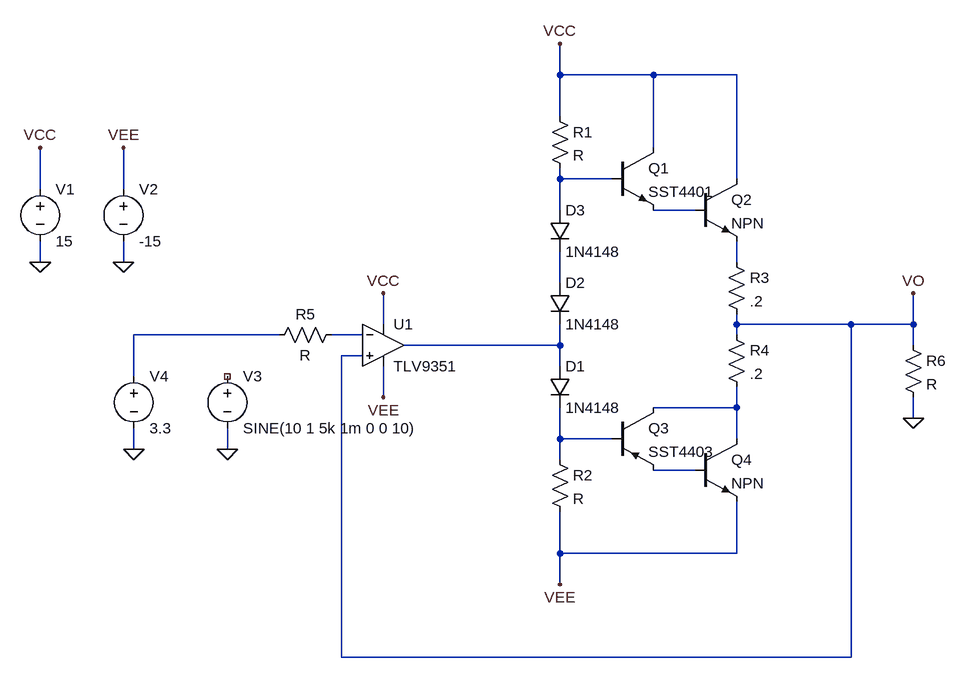
[diagram p0: schematic Current Amp-PowerAmp.asc]
Current Amp-PowerAmp.asc, the LTspice schematic file:
Version 4
SHEET 1 1016 692
WIRE 416 -208 416 -256
WIRE 560 -208 416 -208
WIRE 688 -208 560 -208
WIRE 416 -144 416 -208
WIRE 560 -96 560 -208
WIRE 416 -48 416 -64
WIRE 496 -48 416 -48
WIRE 688 -48 688 -208
WIRE -384 -32 -384 -96
WIRE -256 -32 -256 -96
WIRE 416 0 416 -48
WIRE 624 0 560 0
WIRE -384 80 -384 48
WIRE -256 80 -256 48
WIRE 688 80 688 48
WIRE 416 112 416 64
WIRE 144 176 144 128
WIRE 688 176 688 160
WIRE 864 176 688 176
WIRE 960 176 960 128
WIRE 960 176 864 176
WIRE -16 192 -240 192
WIRE 112 192 64 192
WIRE 688 192 688 176
WIRE 416 208 416 176
WIRE 416 208 176 208
WIRE 960 208 960 176
WIRE 112 224 80 224
WIRE 416 240 416 208
WIRE -240 256 -240 192
WIRE 144 288 144 240
WIRE 688 304 688 272
WIRE 688 304 560 304
WIRE 960 320 960 288
WIRE 416 352 416 304
WIRE 496 352 416 352
WIRE 688 352 688 304
WIRE -240 368 -240 336
WIRE -96 368 -96 336
WIRE 416 384 416 352
WIRE 624 400 560 400
WIRE 416 528 416 464
WIRE 688 528 688 448
WIRE 688 528 416 528
WIRE 416 576 416 528
WIRE 80 688 80 224
WIRE 864 688 864 176
WIRE 864 688 80 688
FLAG -384 80 0
FLAG -256 80 0
FLAG -384 -96 VCC
FLAG -256 -96 VEE
FLAG 144 128 VCC
FLAG 144 288 VEE
FLAG -240 368 0
FLAG -96 368 0
FLAG 416 -256 VCC
FLAG 416 576 VEE
FLAG 960 320 0
FLAG 960 128 VO
SYMBOL Hab_OpAmp\\TLV9351 144 144 R0
SYMATTR InstName U1
SYMBOL voltage -384 -48 R0
WINDOW 123 0 0 Left 0
WINDOW 39 0 0 Left 0
SYMATTR InstName V1
SYMATTR Value 15
SYMBOL voltage -256 -48 R0
WINDOW 123 0 0 Left 0
WINDOW 39 0 0 Left 0
SYMATTR InstName V2
SYMATTR Value -15
SYMBOL diode 400 240 R0
SYMATTR InstName D1
SYMATTR Value 1N4148
SYMBOL diode 400 112 R0
SYMATTR InstName D2
SYMATTR Value 1N4148
SYMBOL diode 400 0 R0
SYMATTR InstName D3
SYMATTR Value 1N4148
SYMBOL npn 496 -96 R0
SYMATTR InstName Q1
SYMATTR Value SST4401
SYMBOL npn 624 -48 R0
SYMATTR InstName Q2
SYMBOL pnp 496 304 R0
SYMATTR InstName Q3
SYMATTR Value SST4403
SYMBOL npn 624 352 R0
SYMATTR InstName Q4
SYMBOL res 400 -160 R0
SYMATTR InstName R1
SYMBOL res 400 368 R0
SYMATTR InstName R2
SYMBOL res 672 64 R0
SYMATTR InstName R3
SYMATTR Value .2
SYMBOL res 672 176 R0
SYMATTR InstName R4
SYMATTR Value .2
SYMBOL res 80 176 R90
WINDOW 0 0 56 VBottom 2
WINDOW 3 32 56 VTop 2
SYMATTR InstName R5
SYMBOL voltage -96 240 R0
WINDOW 123 0 0 Left 0
WINDOW 39 0 0 Left 0
SYMATTR InstName V3
SYMATTR Value SINE(10 1 5k 1m 0 0 10)
SYMBOL voltage -240 240 R0
WINDOW 123 0 0 Left 0
WINDOW 39 0 0 Left 0
SYMATTR InstName V4
SYMATTR Value 3.3
SYMBOL res 944 192 R0
SYMATTR InstName R6

The netlist it stands for:
* Current Amp-PowerAmp.asc
* U1: TLV9351 (symbol Hab_OpAmp\TLV9351 not available, pins judged from their places): In+=VO In-=N006 V+=VCC V-=VEE OUT=N007
V1 VCC 0 15
V2 VEE 0 -15
D1 N007 N009 1N4148
D2 N004 N007 1N4148
D3 N001 N004 1N4148
Q1 VCC N001 N002 0 SST4401
Q2 VCC N002 N003 0 NPN
Q3 N008 N009 N010 0 SST4403
Q4 N008 N010 VEE 0 NPN
R1 VCC N001 R
R2 N009 VEE R
R3 N003 VO .2
R4 VO N008 .2
R5 N006 N005 R
V3 NC_01 0 SINE(10 1 5k 1m 0 0 10)
V4 N005 0 3.3
R6 VO 0 R
.model D D
.lib standard.dio
.model NPN NPN
.model PNP PNP
.lib standard.bjt
.backanno
.end